# EAGLE design multi-pcb-cpu (EAGLE 9.6.2)
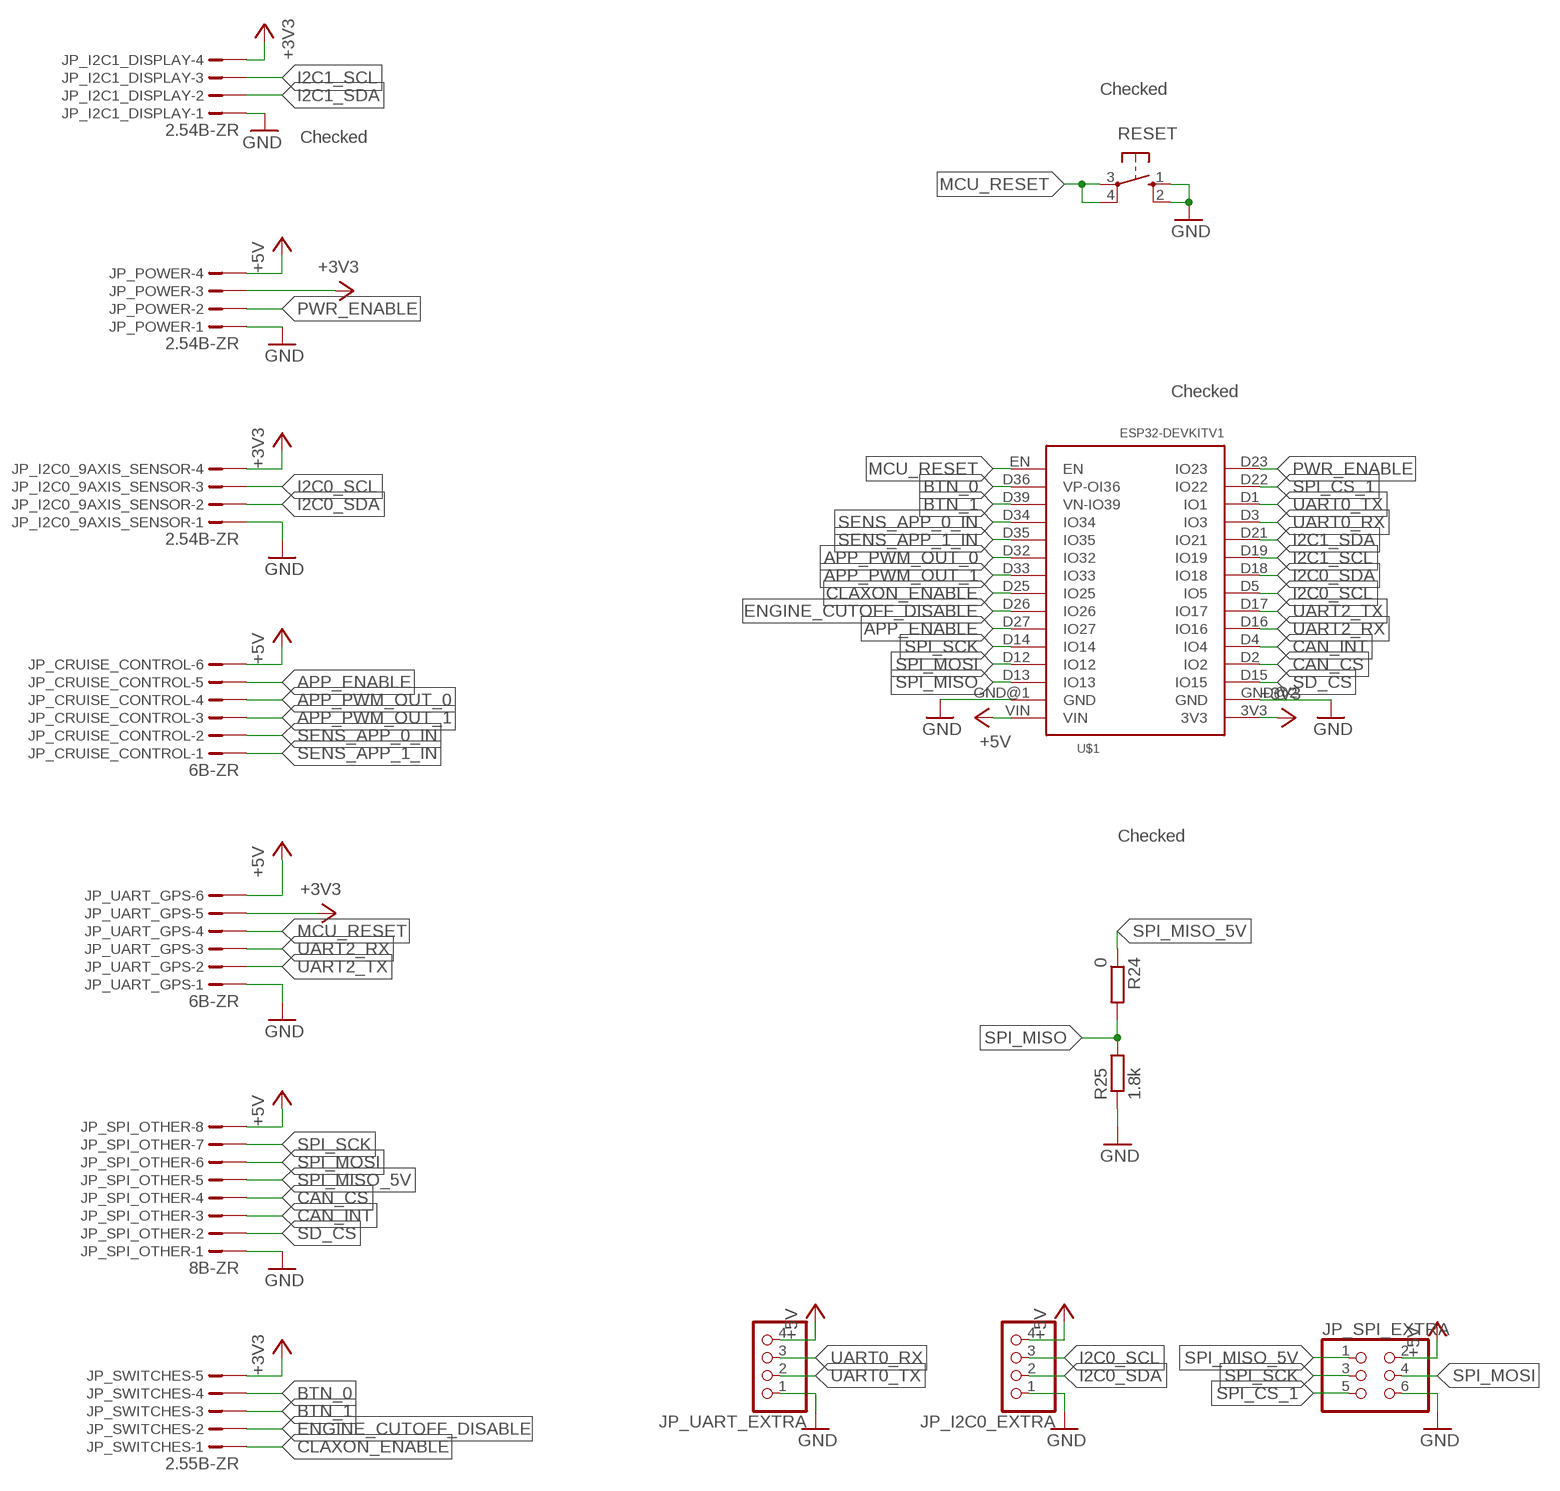
[diagram p0: schematic, sheet 1]

## Parts
JP_CRUISE_CONTROL  6B-ZR  [B6B-ZR2.5]
JP_I2C0_9AXIS_SENSOR  2.54B-ZR  [B4B-ZR2.5]
JP_I2C0_EXTRA  PINHD-1X4  [1X04]
JP_I2C1_DISPLAY  2.54B-ZR  [B4B-ZR2.5]
JP_POWER  2.54B-ZR  [B4B-ZR2.5]
JP_SPI_EXTRA  PINHD-2X3  [2X03]
JP_SPI_OTHER  8B-ZR  [B8B-ZR2.5]
JP_SWITCHES  2.55B-ZR  [B5B-ZR2.5]
JP_UART_EXTRA  PINHD-1X4  [1X04]
JP_UART_GPS  6B-ZR  [B6B-ZR2.5]
R24  0  R-EU_0207/7  [0207/7]
R25  1.8k  R-EU_0207/7  [0207/7]
RESET  10-XX  [B3F-10XX]
U$1  ESP32DEVKITV1  [ESP32-DEVKITV1]

## Nets
+3V3: JP_I2C0_9AXIS_SENSOR.4 JP_I2C1_DISPLAY.4 JP_POWER.3 JP_SWITCHES.5 JP_UART_GPS.5 U$1.3V3
+5V: JP_CRUISE_CONTROL.6 JP_I2C0_EXTRA.4 JP_POWER.4 JP_SPI_EXTRA.2 JP_SPI_OTHER.8 JP_UART_EXTRA.4 JP_UART_GPS.6 U$1.VIN
APP_ENABLE: JP_CRUISE_CONTROL.5 U$1.D27(IO27)
APP_PWM_OUT_0: JP_CRUISE_CONTROL.4 U$1.D32(IO32)
APP_PWM_OUT_1: JP_CRUISE_CONTROL.3 U$1.D33(IO33)
BTN_0: JP_SWITCHES.4 U$1.D36(VP-OI36)
BTN_1: JP_SWITCHES.3 U$1.D39(VN-IO39)
CAN_CS: JP_SPI_OTHER.4 U$1.D2(IO2)
CAN_INT: JP_SPI_OTHER.3 U$1.D4(IO4)
CLAXON_ENABLE: JP_SWITCHES.1 U$1.D25(IO25)
ENGINE_CUTOFF_DISABLE: JP_SWITCHES.2 U$1.D26(IO26)
GND: JP_I2C0_9AXIS_SENSOR.1 JP_I2C0_EXTRA.1 JP_I2C1_DISPLAY.1 JP_POWER.1 JP_SPI_EXTRA.6 JP_SPI_OTHER.1 JP_UART_EXTRA.1 JP_UART_GPS.1 R25.1 RESET.1(S) RESET.2(S1) U$1.GND@1(GND) U$1.GND@2(GND)
I2C0_SCL: JP_I2C0_9AXIS_SENSOR.3 JP_I2C0_EXTRA.3 U$1.D5(IO5)
I2C0_SDA: JP_I2C0_9AXIS_SENSOR.2 JP_I2C0_EXTRA.2 U$1.D18(IO18)
I2C1_SCL: JP_I2C1_DISPLAY.3 U$1.D19(IO19)
I2C1_SDA: JP_I2C1_DISPLAY.2 U$1.D21(IO21)
MCU_RESET: JP_UART_GPS.4 RESET.3(P) RESET.4(P1) U$1.EN
PWR_ENABLE: JP_POWER.2 U$1.D23(IO23)
SD_CS: JP_SPI_OTHER.2 U$1.D15(IO15)
SENS_APP_0_IN: JP_CRUISE_CONTROL.2 U$1.D34(IO34)
SENS_APP_1_IN: JP_CRUISE_CONTROL.1 U$1.D35(IO35)
SPI_CS_1: JP_SPI_EXTRA.5 U$1.D22(IO22)
SPI_MISO: R24.2 R25.2 U$1.D13(IO13)
SPI_MISO_5V: JP_SPI_EXTRA.1 JP_SPI_OTHER.5 R24.1
SPI_MOSI: JP_SPI_EXTRA.4 JP_SPI_OTHER.6 U$1.D12(IO12)
SPI_SCK: JP_SPI_EXTRA.3 JP_SPI_OTHER.7 U$1.D14(IO14)
UART0_RX: JP_UART_EXTRA.3 U$1.D3(IO3)
UART0_TX: JP_UART_EXTRA.2 U$1.D1(IO1)
UART2_RX: JP_UART_GPS.3 U$1.D16(IO16)
UART2_TX: JP_UART_GPS.2 U$1.D17(IO17)

## Notes on the sheet
- Checked
- Checked
- Checked
- Checked

## Library data of the parts
JP_CRUISE_CONTROL JP_UART_GPS = con-jst-custom:?6B-ZR: ZH CONNECTOR 1.5 mm, 4 pin 1 row Source: http://www.jst.com .. eZH.pdf
JP_I2C0_9AXIS_SENSOR JP_I2C1_DISPLAY JP_POWER = con-jst-custom:?4B-ZR: ZH CONNECTOR 1.5 mm, 4 pin 1 row Source: http://www.jst.com .. eZH.pdf
JP_I2C0_EXTRA JP_UART_EXTRA = pinhead:PINHD-1X4: PIN HEADER
JP_SPI_EXTRA = pinhead:PINHD-2X3: PIN HEADER
JP_SPI_OTHER = con-jst-custom:?8B-ZR: ZH CONNECTOR 1.5 mm, 4 pin 1 row Source: http://www.jst.com .. eZH.pdf
JP_SWITCHES = con-jst-custom:?5B-ZR: ZH CONNECTOR 1.5 mm, 4 pin 1 row Source: http://www.jst.com .. eZH.pdf
R24 R25 = rcl:R-EU_: RESISTOR, European symbol; SPICEPREFIX: R
RESET = switch-omron:10-XX: OMRON SWITCH; MPN: B3F-1000; OC_FARNELL: 176432; OC_NEWARK: 36M3542
U$1 = ESP32-DEVKITV1:ESP32DEVKITV1

## Board
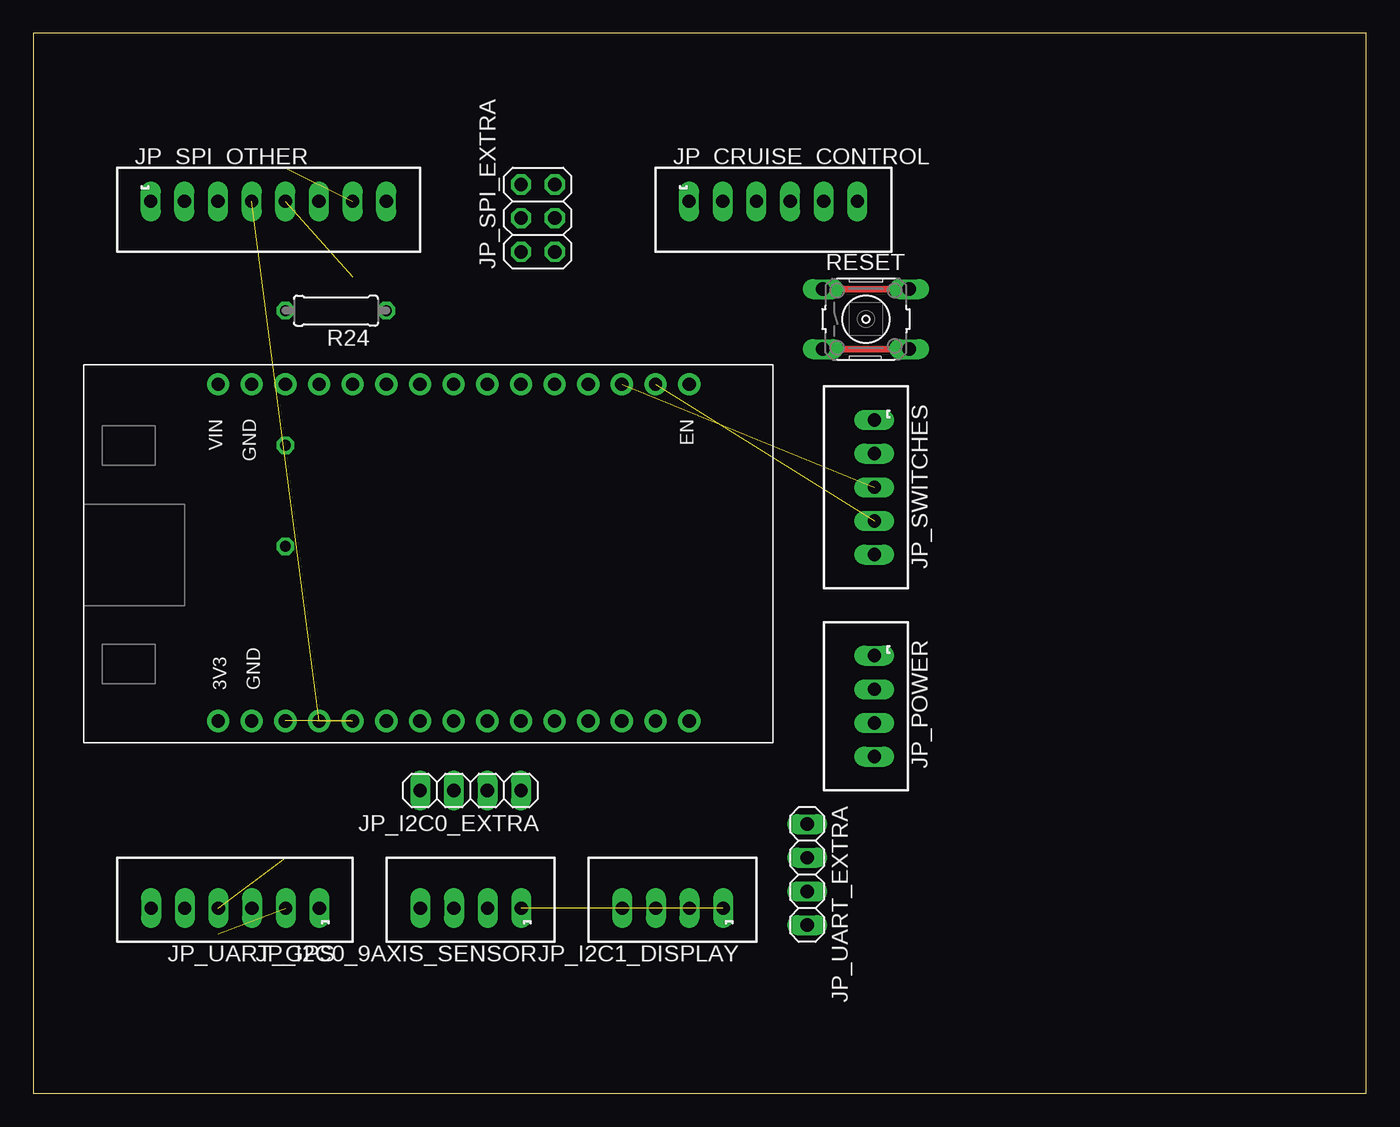
[diagram p1: board, top side]
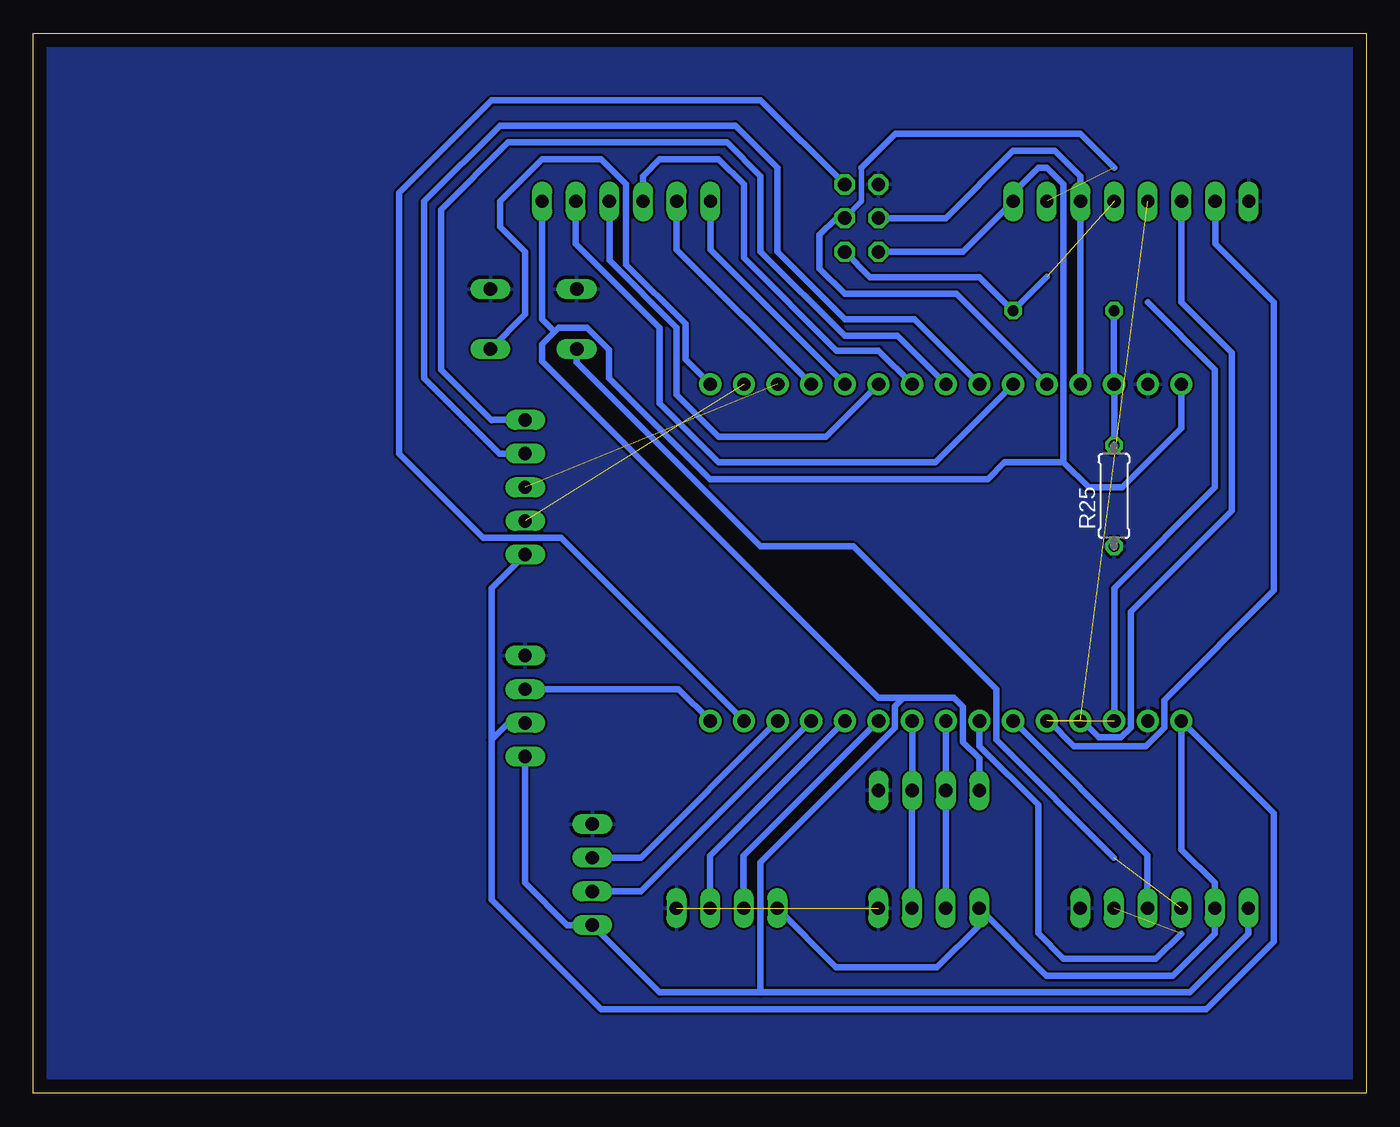
[diagram p2: board, bottom side, seen from below]

Size 100.64 x 80 mm. Coordinates in mm from the lower left corner, seen from the top.
Outline: 0,0 100.64,0 100.64,80 0,80 0,0
Copper layers (1*16): Top 0.035mm / dielectric 1.5mm / Bottom 0.035mm
Design rules "default": minimum track width 6mil, minimum drill 0.35mm, track to track 6mil, track to pad 6mil, pad to pad 6mil, via to via 6mil, smd to smd 6mil, copper to edge 40mil, drill to drill 6mil, minimum pad ring 10mil, minimum via ring 8mil, stop-mask expansion 4mil, vias tented up to drill 0mil, thermal gap 10mil

### Footprints (pad centres in the part's own frame; a part is rotated, then mirrored left to right if it is on the bottom)
B6B-ZR2.5 = drill 1 pad 1.422 long: 1 -6.365,0; 2 -3.823,0; 3 -1.283,0; 4 1.257,0; 5 3.797,0; 6 6.337,0
B4B-ZR2.5 = drill 1 pad 1.422 long: 1 -3.825,0; 2 -1.283,0; 3 1.257,0; 4 3.797,0
1X04 = drill 1.016 long: 1 -3.81,0; 2 -1.27,0; 3 1.27,0; 4 3.81,0
2X03 = drill 1.016 octagon: 1 -2.54,-1.27; 2 -2.54,1.27; 3 0,-1.27; 4 0,1.27; 5 2.54,-1.27; 6 2.54,1.27
B8B-ZR2.5 = drill 1 pad 1.422 long: 1 -8.905,0; 2 -6.363,0; 3 -3.823,0; 4 -1.283,0; 5 1.257,0; 6 3.797,0; 7 6.337,0; 8 8.877,0
B5B-ZR2.5 = drill 1 pad 1.422 long: 1 -5.095,0; 2 -2.553,0; 3 -0.013,0; 4 2.527,0; 5 5.067,0
0207/7 = drill 0.813 octagon: 1 -3.81,0; 2 3.81,0
B3F-10XX = drill 1.016 long: 1 -3.251,2.261; 2 3.251,2.261; 3 -3.251,-2.261; 4 3.251,-2.261
ESP32-DEVKITV1 = drill 1 pad 1.676: 3V3 -15.25,-12.54; D1 15.23,-12.54; D2 -7.63,-12.54; D3 12.69,-12.54; D4 -5.09,-12.54; D5 2.53,-12.54; D12 -7.63,12.865; D13 -10.17,12.865; D14 -5.09,12.865; D15 -10.17,-12.54; D16 -2.55,-12.54; D17 -0.01,-12.54; D18 5.07,-12.54; D19 7.61,-12.54; D21 10.15,-12.54; D22 17.77,-12.54; D23 20.31,-12.54; D25 2.53,12.865; D26 -0.01,12.865; D27 -2.55,12.865; D32 7.61,12.865; D33 5.07,12.865; D34 12.69,12.865; D35 10.15,12.865; D36 17.77,12.865; D39 15.23,12.865; EN 20.31,12.865; GND@1 -12.71,12.865; GND@2 -12.71,-12.54; VIN -15.25,12.865

### Placement (x,y rotation side)
JP_CRUISE_CONTROL  55.88,67.31 0 top
JP_I2C0_9AXIS_SENSOR  33.02,13.97 180 top
JP_I2C0_EXTRA  33.02,22.86 180 top
JP_I2C1_DISPLAY  48.26,13.97 180 top
JP_POWER  63.5,29.21 270 top
JP_SPI_EXTRA  38.1,66.04 90 top
JP_SPI_OTHER  17.78,67.31 0 top
JP_SWITCHES  63.5,45.72 270 top
JP_UART_EXTRA  58.42,16.51 270 top
JP_UART_GPS  15.24,13.97 180 top
R24  22.86,59.05 180 top
R25  19.05,45.09 90 bottom
RESET  62.87,58.42 0 top
U$1  29.21,40.64 0 top

### Tracks (layer width: path | path; a pad name or v marks a point on that pad's centre or on a via)
+3V3
  Bottom 0.508: JP_I2C1_DISPLAY.4 40.02,9.53 32.4,9.53 29.22,12.7 JP_I2C0_9AXIS_SENSOR.4 24.14,8.89 14.61,8.89 11.44,12.05 JP_UART_GPS.5 11.44,15.88 13.96,18.39 U$1.3V3 6.99,21.12 6.99,11.43 12.06,6.35 57.78,6.35 66.04,14.61 66.04,26.67 | JP_POWER.3 64.76,27.95 66.04,26.67 | JP_SWITCHES.5 66.04,38.11 66.04,26.67
+5V
  Bottom 0.508: JP_SPI_EXTRA.2 30.47,63.5 JP_SPI_OTHER.8 26.66,67.96 24.77,69.85 24.13,69.85 22.86,68.58 22.86,47.62 | JP_POWER.4 63.5,15.88 60.33,12.7 JP_UART_EXTRA.4 53.34,7.62 45.72,7.62 | JP_UART_GPS.6 8.9,12.05 13.34,7.62 45.72,7.62 | JP_I2C0_EXTRA.4 29.21,25.27 30.45,26.51 30.45,29.18 31.11,29.84 34.92,29.84 | 34.92,29.84 35.58,29.2 35.58,27.58 45.72,17.44 45.72,7.62 | 22.86,47.62 20.95,45.72 18.41,45.72 13.96,50.17 U$1.VIN | 22.86,47.62 27.3,47.62 28.57,46.35 49.53,46.35 57.15,53.98 57.15,56.11 58.83,57.78 60.96,57.78 61.28,57.47 | 61.28,57.47 62.23,56.52 62.23,55.24 36.83,29.84 34.92,29.84 | JP_CRUISE_CONTROL.6 62.22,58.41 61.28,57.47
APP_ENABLE
  Bottom 0.508: JP_CRUISE_CONTROL.5 59.68,64.12 53.34,57.78 53.34,52.07 48.9,47.62 32.54,47.62 U$1.D27
APP_PWM_OUT_0
  Bottom 0.508: JP_CRUISE_CONTROL.4 57.14,62.85 52.07,57.78 52.07,52.7 48.9,49.53 40.8,49.53 U$1.D32
APP_PWM_OUT_1
  Bottom 0.508: JP_CRUISE_CONTROL.3 54.6,69.2 54.61,69.22 53.34,70.48 48.9,70.48 46.99,68.58 46.99,63.04 39.99,56.05 36.82,56.05 U$1.D33
BTN_0  (1 unrouted)
BTN_1  (1 unrouted)
CAN_CS  (1 unrouted)
CAN_INT  (1 unrouted)
  Bottom 0.508: JP_SPI_OTHER.3 13.96,59.68 10.16,55.88 10.16,43.97 17.8,36.33 17.8,27.58 18.52,26.86 20.19,26.86 21.43,28.1
CLAXON_ENABLE
  Bottom 0.508: JP_SWITCHES.1 66.03,50.81 66.04,50.8 69.85,54.61 69.85,66.67 64.77,71.75 48.26,71.75 45.72,69.22 45.72,63.5 39.37,57.15 35.38,57.15 U$1.D25
ENGINE_CUTOFF_DISABLE
  Bottom 0.508: JP_SWITCHES.2 65.42,48.27 71.12,53.98 71.12,67.31 65.41,73.03 47.62,73.03 44.45,69.85 44.45,63.5 39.37,58.42 34.12,58.42 U$1.D26
GND  (1 unrouted)
  Top 0.508: RESET.1 RESET.2
  pour Bottom: 0,80.01 0,0 100.33,0 100.33,80.01
I2C0_SCL
  Bottom 0.508: JP_I2C0_9AXIS_SENSOR.3 31.75,13.98 JP_I2C0_EXTRA.3 U$1.D5
I2C0_SDA
  Bottom 0.508: U$1.D18 JP_I2C0_EXTRA.2 34.3,22.85 JP_I2C0_9AXIS_SENSOR.2
I2C1_SCL
  Bottom 0.508: JP_I2C1_DISPLAY.3 47,17.92 U$1.D19
I2C1_SDA
  Bottom 0.508: JP_I2C1_DISPLAY.2 49.54,17.92 U$1.D21
MCU_RESET  (1 unrouted)
  Top 0.508: RESET.4 RESET.3
  Bottom 0.508: U$1.EN 51.41,55.4 51.41,58.06 55.88,62.53 55.88,68.58 57.78,70.48 62.23,70.48 65.41,67.31 65.41,65.41 63.5,63.5 63.5,58.78 RESET.4 | RESET.3 59.61,55.17 45.72,41.27 38.73,41.27 27.94,30.48 27.94,26.67 19.06,17.79
PWR_ENABLE
  Bottom 0.508: U$1.D23 51.91,30.49 JP_POWER.2
SD_CS  (1 unrouted)
  Bottom 0.508: U$1.D15 19.04,38.11 11.43,45.72 11.43,54.61 16.5,59.68 | JP_SPI_OTHER.2 11.42,64.12 6.99,59.69 6.99,37.95 15.26,29.68 15.26,27.58 16.64,26.2 22.07,26.2 23.98,28.1
SENS_APP_0_IN
  Bottom 0.508: JP_CRUISE_CONTROL.2 52.06,63.66 U$1.D34
SENS_APP_1_IN
  Bottom 0.508: JP_CRUISE_CONTROL.1 49.52,63.66 U$1.D35
SPI_CS_1
  Bottom 0.508: U$1.D22 60.79,41.91 66.67,41.91 73.03,48.26 73.03,67.94 66.04,74.93 45.72,74.93 JP_SPI_EXTRA.5
SPI_MISO
  Bottom 0.508: R24.2 U$1.D13 R25.2
SPI_MISO_5V  (1 unrouted)
  Bottom 0.508: 24.12,61.61 R24.1 29.21,61.59 37.47,61.59 JP_SPI_EXTRA.1
SPI_MOSI
  Bottom 0.508: U$1.D12 JP_SPI_OTHER.6 21.58,69.2 23.5,71.12 26.67,71.12 31.75,66.04 JP_SPI_EXTRA.4
SPI_SCK  (1 unrouted)
  Bottom 0.406: JP_SPI_EXTRA.3 38.1,67.31 38.1,69.85
  Bottom 0.508: JP_SPI_EXTRA.3 40.01,66.04 41.27,64.77 41.27,62.23 39.37,60.33 30.94,60.33 U$1.D14 | 38.1,69.85 35.56,72.39 21.58,72.39 19.04,69.85
UART0_RX
  Bottom 0.508: JP_UART_EXTRA.3 54.76,15.24 U$1.D3
UART0_TX
  Bottom 0.508: JP_UART_EXTRA.2 54.76,17.78 U$1.D1
UART2_RX
  Bottom 0.508: JP_UART_GPS.3 16.52,17.96 U$1.D16
UART2_TX  (1 unrouted)
  Bottom 0.508: 13.98,12.05 15.88,10.16 22.86,10.16 24.77,12.06 24.77,21.76 29.2,26.2 U$1.D17